# EAGLE design USB Host Wing RP2040 (EAGLE 9.5.2)
COMPANY: ADAFRUIT INDUSTRIES; DRAWN: KTOWN; REV: B
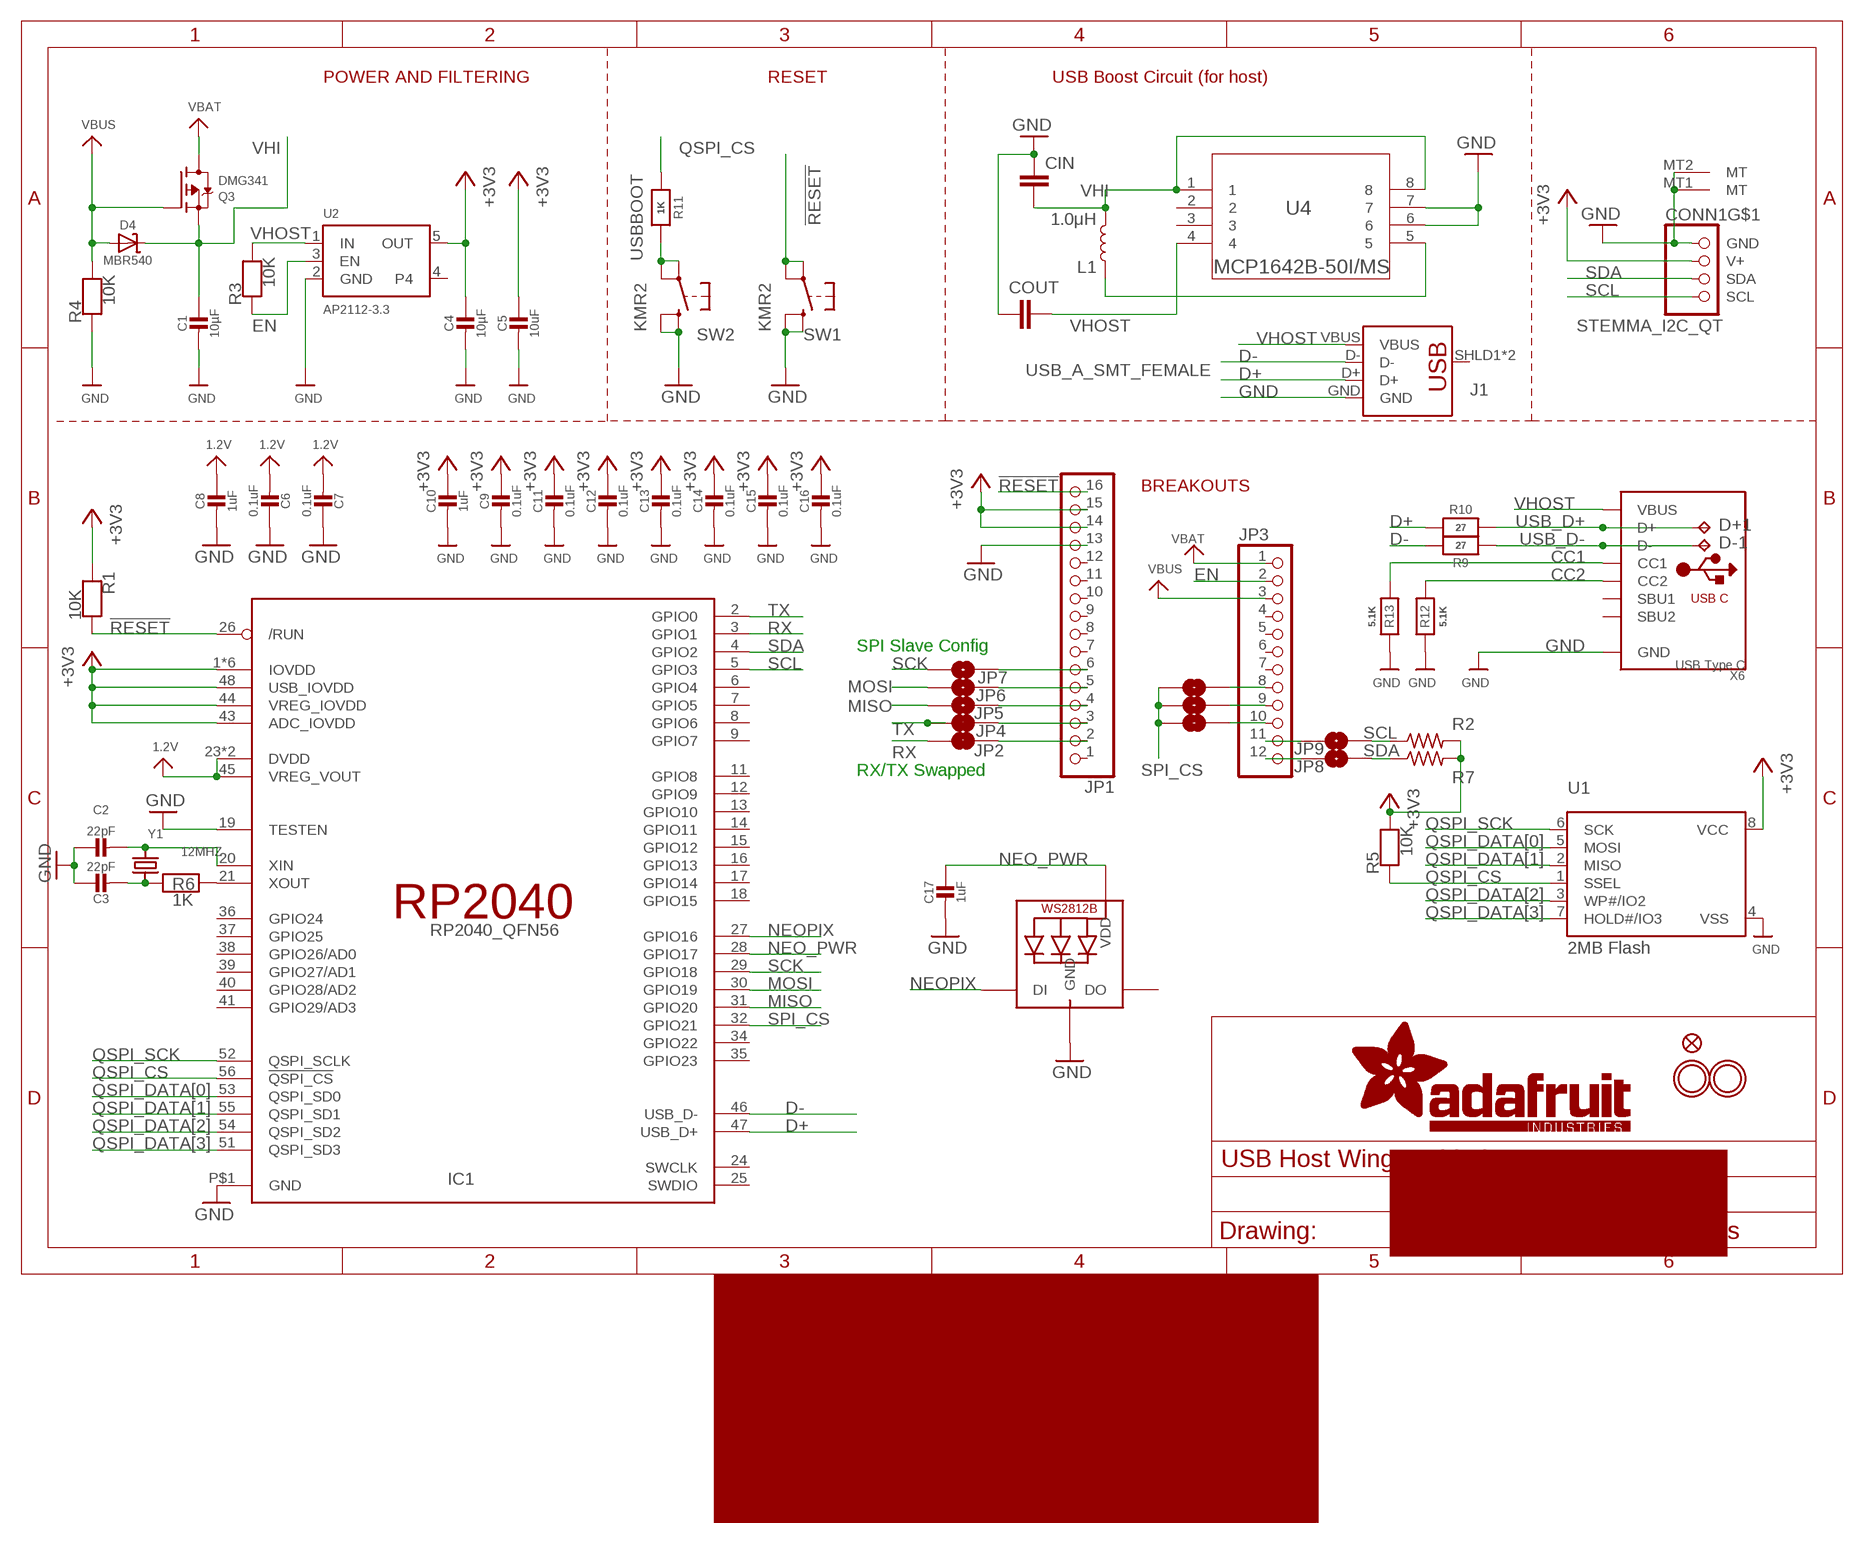
[diagram p0: schematic, sheet 1]

## Parts
C1  10µF  CAP_CERAMIC0805-NOOUTLINE  [0805-NO]
C2  22pF  CAP_CERAMIC0603_NO  [0603-NO]
C3  22pF  CAP_CERAMIC0603_NO  [0603-NO]
C4  10µF  CAP_CERAMIC0805-NOOUTLINE  [0805-NO]
C5  10uF  CAP_CERAMIC0805-NOOUTLINE  [0805-NO]
C6  0.1uF  CAP_CERAMIC0603_NO  [0603-NO]
C7  0.1uF  CAP_CERAMIC0603_NO  [0603-NO]
C8  1uF  CAP_CERAMIC0603_NO  [0603-NO]
C9  0.1uF  CAP_CERAMIC0603_NO  [0603-NO]
C10  1uF  CAP_CERAMIC0603_NO  [0603-NO]
C11  0.1uF  CAP_CERAMIC0603_NO  [0603-NO]
C12  0.1uF  CAP_CERAMIC0603_NO  [0603-NO]
C13  0.1uF  CAP_CERAMIC0603_NO  [0603-NO]
C14  0.1uF  CAP_CERAMIC0603_NO  [0603-NO]
C15  0.1uF  CAP_CERAMIC0603_NO  [0603-NO]
C16  0.1uF  CAP_CERAMIC0603_NO  [0603-NO]
C17  1uF  CAP_CERAMIC0603_NO  [0603-NO]
CIN  SPARKFUN_CAP0603-CAP  [SPARKFUN_0603-CAP]
CONN1  STEMMA_I2C_QT  [JST_SH4]
COUT  SPARKFUN_CAP0603-CAP  [SPARKFUN_0603-CAP]
D4  MBR540  DIODE-SCHOTTKYSOD-123  [SOD-123]
D+1  TPB1,27  [B1,27]
D-1  TPB1,27  [B1,27]
IC1  RP2040_QFN56  [QFN56_7MM_REDUCEDEPAD]
J1  USB_A_SMT_FEMALE  [USB-A-S-SILK-FEMALE]
JP1  HEADER-1X16ROUND  [1X16_ROUND]
JP2  JUMPER-SMT_2_NC_TRACE_SILK  [SMT-JUMPER_2_NC_TRACE_SILK]
JP3  HEADER-1X12  [1X12_ROUND]
JP4  JUMPER-SMT_2_NC_TRACE_SILK  [SMT-JUMPER_2_NC_TRACE_SILK]
JP5  JUMPER-SMT_2_NO_SILK  [SMT-JUMPER_2_NO_SILK]
JP6  JUMPER-SMT_2_NO_SILK  [SMT-JUMPER_2_NO_SILK]
JP7  JUMPER-SMT_2_NO_SILK  [SMT-JUMPER_2_NO_SILK]
JP8  JUMPER-SMT_2_NO_SILK  [SMT-JUMPER_2_NO_SILK]
JP9  JUMPER-SMT_2_NO_SILK  [SMT-JUMPER_2_NO_SILK]
JP10  JUMPER-SMT_2_NO_SILK  [SMT-JUMPER_2_NO_SILK]
JP11  JUMPER-SMT_2_NO_SILK  [SMT-JUMPER_2_NO_SILK]
JP12  JUMPER-SMT_2_NO_SILK  [SMT-JUMPER_2_NO_SILK]
L1  1.0μH  1.0μH-0805_WIDE-1.0μH-1.4A-0.07OHM-1.4MM_H  [0805-WIDE]
LED1  WS2812B3535  [LED3535]
Q3  DMG341  MOSFET-P  [SOT23-R]
R1  10K  RESISTOR_0603_NOOUT  [0603-NO]
R2  R-US_R0603  [R0603]
R3  10K  RESISTOR_0603_NOOUT  [0603-NO]
R4  10K  RESISTOR_0603_NOOUT  [0603-NO]
R5  10K  RESISTOR_0603_NOOUT  [0603-NO]
R6  1K  RESISTOR_0603_NOOUT  [0603-NO]
R7  R-US_R0603  [R0603]
R9  27  RESISTOR_0603_NOOUT  [0603-NO]
R10  27  RESISTOR_0603_NOOUT  [0603-NO]
R11  1K  RESISTOR_0603_NOOUT  [0603-NO]
R12  5.1K  RESISTOR_0603_NOOUT  [0603-NO]
R13  5.1K  RESISTOR_0603_NOOUT  [0603-NO]
SW1  KMR2  SWITCH_TACT_SMT4.6X2.8  [BTN_KMR2_4.6X2.8]
SW2  KMR2  SWITCH_TACT_SMT4.6X2.8  [BTN_KMR2_4.6X2.8]
U1  2MB Flash  SPIFLASH_8PIN208MIL  [SOIC8_208MIL]
U2  AP2112-3.3  VREG_SOT23-5  [SOT23-5@1]
U4  MCP1642B-50I/MS  [MSOP8_MCP1642B-50I/MS_MCH]
U$31  MOUNTINGHOLE2.5  [MOUNTINGHOLE_2.5_PLATED]
U$32  MOUNTINGHOLE2.5  [MOUNTINGHOLE_2.5_PLATED]
U$35  FIDUCIAL_1MM  [FIDUCIAL_1MM]
X6  USB Type C  USB_C  [USB_C_CUSB31-CFM2AX-01-X]
Y1  12MHZ  CRYSTAL2.5X2.0  [CRYSTAL_2.5X2]

## Nets
1.2V: C6.2 C7.2 C8.1 IC1.23(DVDD) IC1.45(VREG_VOUT) IC1.50(DVDD)
!RESET: IC1.26(/RUN) JP1.16 R1.2 SW1.A'(P1) SW1.A(P)
+3V3: C4.1 C5.1 C9.1 C10.1 C11.1 C12.1 C13.1 C14.1 C15.1 C16.1 CONN1.2(V+) IC1.1(IOVDD) IC1.10(IOVDD) IC1.22(IOVDD) IC1.33(IOVDD) IC1.42(IOVDD) IC1.43(ADC_IOVDD) IC1.44(VREG_IOVDD) IC1.48(USB_IOVDD) IC1.49(IOVDD) JP1.14 JP1.15 R1.1 R2.2 R5.2 R7.2 U1.8(VCC) U2.5(OUT)
CC1: R13.2 X6.A5(CC1)
CC2: R12.2 X6.B5(CC2)
D+: IC1.47(USB_D+) J1.D+ R10.2
D-: IC1.46(USB_D-) J1.D- R9.2
EN: JP3.2 R3.1 U2.3(EN)
GND [power]: C1.2 C2.1 C3.1 C4.2 C5.2 C6.1 C7.1 C8.2 C9.2 C10.2 C11.2 C12.2 C13.2 C14.2 C15.2 C16.2 C17.2 CIN.1 CONN1.1(GND) CONN1.MT1(MT) CONN1.MT2(MT) COUT.1 IC1.19(TESTEN) IC1.P$1(GND) J1.GND JP1.13 LED1.4(GND) R4.1 R12.1 R13.1 SW1.B'(S1) SW1.B(S) SW2.B'(S1) SW2.B(S) U1.4(VSS) U2.2(GND) U4.6 U4.7 X6.A1B12(GND) X6.B1A12(GND)
MISO: IC1.31(GPIO20) JP5.1
MOSI: IC1.30(GPIO19) JP6.1
N$1: JP1.6 JP7.2
N$2: JP1.5 JP6.2
N$3: JP1.4 JP5.2
N$4: JP1.3 JP4.2
N$5: C2.2 IC1.20(XIN) Y1.3
N$6: C3.2 R6.1 Y1.1
N$7: IC1.21(XOUT) R6.2
N$8: JP1.2 JP2.2
N$9: JP3.11 JP9.1
N$10: L1.1 U4.5
N$11: JP3.12 JP8.1
N$12: JP3.8 JP12.2
N$13: JP3.9 JP11.2
N$14: JP3.10 JP10.2
NEO_PWR: C17.1 IC1.28(GPIO17) LED1.2(VDD)
NEOPIX: IC1.27(GPIO16) LED1.1(DI)
QSPI_CS: IC1.56(!QSPI_CS) R5.1 R11.1 U1.1(SSEL)
QSPI_DATA[0]: IC1.53(QSPI_SD0) U1.5(MOSI)
QSPI_DATA[1]: IC1.55(QSPI_SD1) U1.2(MISO)
QSPI_DATA[2]: IC1.54(QSPI_SD2) U1.3(WP#/IO2)
QSPI_DATA[3]: IC1.51(QSPI_SD3) U1.7(HOLD#/IO3)
QSPI_SCK: IC1.52(QSPI_SCLK) U1.6(SCK)
RX: IC1.3(GPIO1) JP2.1
SCK: IC1.29(GPIO18) JP7.1
SCL: CONN1.4(SCL) IC1.5(GPIO3) JP9.2 R2.1
SDA: CONN1.3(SDA) IC1.4(GPIO2) JP8.2 R7.1
SPI_CS: IC1.32(GPIO21) JP10.1 JP11.1 JP12.1
TX: IC1.2(GPIO0) JP4.1
USB_D+: D+1.TP R10.1 X6.A6(D+) X6.B6(D+)
USB_D-: D-1.TP R9.1 X6.A7(D-) X6.B7(D-)
USBBOOT: R11.2 SW2.A'(P1) SW2.A(P)
VBAT [power]: JP3.1 Q3.3(D)
VBUS [power]: D4.A JP3.3 Q3.1(G) R4.2
VHI [power]: C1.1 CIN.2 D4.C L1.2 Q3.2(S) U4.1 U4.8
VHOST: COUT.2 J1.VBUS R3.2 U2.1(IN) U4.4 X6.A4B9(VBUS) X6.B4A9(VBUS)
Unconnected: IC1.6(GPIO4) IC1.7(GPIO5) IC1.8(GPIO6) IC1.9(GPIO7) IC1.11(GPIO8) IC1.12(GPIO9) IC1.13(GPIO10) IC1.14(GPIO11) IC1.15(GPIO12) IC1.16(GPIO13) IC1.17(GPIO14) IC1.18(GPIO15) IC1.24(SWCLK) IC1.25(SWDIO) IC1.34(GPIO22) IC1.35(GPIO23) IC1.36(GPIO24) IC1.37(GPIO25) IC1.38(GPIO26/AD0) IC1.39(GPIO27/AD1) IC1.40(GPIO28/AD2) IC1.41(GPIO29/AD3) J1.SHLD1(SHIELD) J1.SHLD2(SHIELD) JP1.1 JP1.7 JP1.8 JP1.9 JP1.10 JP1.11 JP1.12 JP3.4 JP3.5 JP3.6 JP3.7 LED1.3(DO) U2.4 U4.2 U4.3 X6.A8(SBU1) X6.B8(SBU2)

## Notes on the sheet
- POWER AND FILTERING | RESET | USB Boost Circuit (for host)
- BREAKOUTS
- SPI Slave Config
- RX/TX Swapped

## Library data of the parts
C1-C3 C5-C17 = microbuilder:CAP_CERAMIC: Ceramic Capacitors For new designs, use the packages preceded by an '_' character since they are more reliable: The following footprints should be used on most boards: _0402 - Standard footprint for regular board layouts _0603 - Standard footprint for regular board layouts _0805 - Standard footprint for regular board layouts _1206 - Standard footprint for regular board layouts For extremely tight-pitch boards where space is at a premium, the following 'micro-pitch' footprints can be used (smaller pads, no silkscreen outline, etc.): _0402MP - Micro-pitch footprint for very dense/compact boards _0603MP - Micro-pitch footprint for very dense/compact boards _0805MP - Micro-pitch footprint for very dense/compact boards _1206MP - Micro-pitch footprint for very dense/compact boards
C4 = microbuilder:CAP_CERAMIC: Ceramic Capacitors For new designs, use the packages preceded by an '_' character since they are more reliable: The following footprints should be used on most boards: _0402 - Standard footprint for regular board layouts _0603 - Standard footprint for regular board layouts _0805 - Standard footprint for regular board layouts _1206 - Standard footprint for regular board layouts For extremely tight-pitch boards where space is at a premium, the following 'micro-pitch' footprints can be used (smaller pads, no silkscreen outline, etc.): _0402MP - Micro-pitch footprint for very dense/compact boards _0603MP - Micro-pitch footprint for very dense/compact boards _0805MP - Micro-pitch footprint for very dense/compact boards _1206MP - Micro-pitch footprint for very dense/compact boards; REV: A
CIN COUT = DECADE:SPARKFUN_CAP: Capacitor Standard 0603 ceramic capacitor, and 0.1" leaded capacitor.
CONN1 = microbuilder:STEMMA_I2C
D4 = microbuilder:DIODE-SCHOTTKY
D+1 D-1 = testpad:TP: Test pad
IC1 = adafruit_micro:RP2040
J1 = SparkFun-Connectors:USB_A: USB-A Connector Male and female variants, as well as PTH and SMT variants SparkFun Products: SparkFun XBee Explorer Dongle <https://www.sparkfun.com/products/11697> PTH Male SparkFun MicroView-USB Programmer <https://www.sparkfun.com/products/12924> SMT Male SparkFun USB Type A Female Breakout <https://www.sparkfun.com/products/12700> SMT Female; PROD_ID: CONN-09520; SF_ID: PRT-09011
JP1 = microbuilder:HEADER-1X16: PIN HEADER
JP2 JP4 = SparkFun-Jumpers:JUMPER-SMT_2_NC_TRACE: Normally closed trace jumper This jumper has a trace between two pads so it's normally closed (NC). Use a razor knife to open the connection. For best results follow the IPC guidelines for cutting traces: Cutout at least 0.063 mm (0.005 in). Remove all loose material to clean up the cut area. Seal the cut with an approved epoxy. Reapply solder to reclose the connection.
JP3 = microbuilder:HEADER-1X12
JP5-JP12 = SparkFun-Jumpers:JUMPER-SMT_2_NO: Normally open jumper This jumper has two pads in close proximity to each other. Apply solder to close the connection. Round pads are easier to solder for beginners, but are a lot larger. SparkFun Product that uses the round pads: SparkFun EL Sequencer <https://www.sparkfun.com/products/12781>
L1 = SparkFun-Coils:1.0μH: 1.0μH Inductor Resist changes in electrical current. Basically a coil of wire. SparkFun Products: SparkFun Edge <https://www.sparkfun.com/products/15170>; PROD_ID: NDUC-14237
LED1 = microbuilder:WS2812B
Q3 = microbuilder:MOSFET-P: P-Channel Mosfet LEGEND VDS: Voltage Drain-Source ID: Drain Current RDS(ON): Drain-Source On-State Resistance VGS(TH): Gate-Source Threshold Voltage CISS: Drain-Source Input Capacitance SOT-23 Name VDS ID RDS(ON) VGS(TH) CISS Order Number IRLML5103 30V 760mA 600 mOhm -- 75pF @ 25V Digikey: IRLML5103PBFCT-ND IRLML6401 12V 4.3A 50 mOhm 950mV @ 250µA 830pF @ 10V Digikey: IRLML6401PBFTR-ND NTR0202PL 20V 400mA 800 mOhm 2.3V @ 250uA 70pF @ 5V Digikey: NTR0202PLT1GOSTR-ND NTR4101PT1G 20V 1.8A 85 mOhm 1.2V @ 250uA 675pF @ 10V Digikey: NTR4101PT1GOSCT-ND DMP2004K 20V 600mA 900 mOhm 1V @ 250uA 175pF @ 16V Digikey: DMP2004KDICT-ND PMV65XP 20V 3.9A 76 mOhm 950mV @ 1mA 725pF @ 20V Digikey: 568-2358-2-ND TO-252 Name VDS ID RDS(ON) VGS(TH) CISS Order Number AOD417 30V 25A 34 mOhm 3V @ 250µA 920pF @ 15V Digikey: 785-1106-2-ND PowerPak Name VDS ID RDS(ON) VGS(TH) CISS Order Number AON7401 30V 12A 14 mOhm 3V @ 250µA 2600pF @ 15V Digikey: 785-1302-1-ND
R1 R3-R6 R9-R13 = microbuilder:RESISTOR: Resistors For new designs, use the packages preceded by an '_' character since they are more reliable: The following footprints should be used on most boards: _0402 - Standard footprint for regular board layouts _0603 - Standard footprint for regular board layouts _0805 - Standard footprint for regular board layouts _1206 - Standard footprint for regular board layouts For extremely tight-pitch boards where space is at a premium, the following 'micro-pitch' footprints can be used (smaller pads, no silkscreen outline, etc.): _0402MP - Micro-pitch footprint for very dense/compact boards _0603MP - Micro-pitch footprint for very dense/compact boards _0805MP - Micro-pitch footprint for very dense/compact boards _1206MP - Micro-pitch footprint for very dense/compact boards
R2 R7 = adafruit:R-US_: RESISTOR, American symbol
SW1 SW2 = microbuilder:SWITCH_TACT_SMT: SMT Tact Switches 6x6mm - Digikey: P12940SCT-ND KMR2 (4.6x2.8mm) - Digikey: 401-1426-1-ND EVQ-PQHB55 - Light Touch, 160GF (4.5x4.5mm) - Digikey: P8090SCT-ND KMT0 - KMT021 NGJ LHS (etc.) IP68/Waterproof - Digikey: CKN10289CT-ND
U1 = microbuilder:SPIFLASH_8PIN: SOIC8 SPI Flash Be careful with the size since SOIC8 flash comes in several 'widths' SOIC8 150 mil M25P16 - 16Mbit (2Mbit x 8) Serial Flash (75MHz SPI Bus), Supply: 2.7-3.6V Digikey: SOIC8 - M25P16-VMN6P-ND SOIC8 208 mil W25Q16BVSSIG - 16Mbit (2Mbit x 8) Serial Flash (104MHz SPI Bus), Supply: 2.7-3.6V Digikey: SOIC8 - W25Q16BVSSIG-ND
U2 = microbuilder:VREG_SOT23-5: SOT23-5 Fixed Voltage Regulators Part Current Out V Out V In V Dropout θJA (°C/W) TJ (°C) Digikey Part No. ADP121 150mA 3.3V 3.4-5.5V 0.09V @ 150mA -- -- ADP121-AUJZ33R7CT-ND ADP121 150mA 3.0V 3.1-5.5V 0.09V @ 150mA -- -- ADP121-AUJZ30R7CT-ND ADP122 300mA 3.3V 3.4-5.5V 0.085V @ 300mA -- -- ADP122AUJZ-3.3-R7CT-ND ADP1712 300mA 3.3V 3.5-5.5V 0.17V @ 300mA -- -- ADP1712AUJZ-3.3-R7TR-ND AP7311 (Low Cost) 150mA 3.3V 3.5-6V 0.15V @ 150mA -- -- AP7311-33WG-7DICT-ND LD39015M18R 150mA 1.8V 1.9V-5.5V 0.08V @ 100mA -- -- 497-6977-1-ND LP2985A-33DBVR 150mA 3.3V 3.3-16V 0.28V @ 150mA 206 150 296-18479-1-ND MCP1824T-3302E/OT 300mA 3.3V 3.5V-6V 0.2V @ 300mA -- -- MCP1824T-3302E/OTCT-ND MIC5205-2.5YM5 TR 150mA 2.5V 2.7-16V 0.165V @ 150mA -- -- 576-1257-2-ND MIC5205-3.0YM5 TR 150mA 3.0V 3.2V-16V 0.165V @ 150mA -- -- 576-1258-2-ND MIC5205-3.3YM5 TR 150mA 3.3V 3.5V-16V 0.165V @ 150mA -- -- 576-1259-2-ND TPS780330220 150mA 3.3V+2.2V 3.6-5.5V 250mV Max -- -- 296-23332-1-ND TDA3663/N1,135 100mA 3.3V 3.5-45V 0.18V @ 50mA -- -- 568-5343-1-ND Max operating temp can be calculated using θJA, TJ (max junction temperature), and power in watts. Set the "Maximum Ambient Temperature" until it reaches TJ ("Max Junction Temperature"), which is the absolute limit for safe use of the regulator: Heat Sink Temperature Calculator <http://www.daycounter.com/Calculators/Heat-Sink-Temperature-Calculator.phtml> For example, With 12V source into a 3.3V LP2985 and a 30mA load, we are dissipating (12V-3.3V) * 0.03A = 0.261W. With a θJA of 206 °C/W, a TJ of 150°C, and 261mW we can safely use the chip without a heat sink up to 75°C (=147.1°C Junction Temperature).
U4 = ATMakers:MCP1642B-50I/MS; BUILT_BY: EMA_Kyle; COPYRIGHT: Copyright (C) 2018 Accelerated Designs. All rights reserved; DATASHEET: https://ww1.microchip.com/downloads/en/DeviceDoc/20005253A.pdf; MANUFACTURER_PART_NUMBER: MCP1642B-50I/MS; SOURCELIBRARY: Add_to_database_2021-01-13; VENDOR: Microchip
U$31 U$32 = microbuilder:MOUNTINGHOLE: Mounting Hole For #2 screws (0.086"/2.18mm width, 0.094"/2.4mm hole) use 2.5mm; BOM: EXCLUDE
U$35 = microbuilder:FIDUCIAL: Fiducial Alignment Points Various fiducial points for machine vision alignment.; BOM: EXCLUDE
X6 = microbuilder:USB_C: USB Type-C USB 2.0 Connector
Y1 = microbuilder:CRYSTAL: Crystals HC49UP - Surface Mount Crystal 4.0MHz 18pF +/-30ppm Surface Mount Crystal [Digikey: 535-9857-1-ND] 12.0 MHz Surface Mount Crystal [Digikey: 535-9869-6-ND] 25.0 MHz Surface Mount Crystal [Digikey: 535-9078-1-ND] 2.5 x 2.0mm - MEMs SMT Crystal 16.0 MHz 10pF 20ppm 2.5 x 2.0mm Crystal [Digikey -40-85°C: 535-10923-1-ND] 3.2 x 2.5mm - MEMs SMT Crystal 12.0 MHz 8pF 15ppm 3.2 x 2.5mm Crystal [Digikey: -10-70°C: 644-1047-1-ND -40-125°C: 644-1128-1-ND] 40~85°C cheaper: 644-1173-6-ND 16.0 MHz 8pF 15ppm 3.2 x 2.5mm Crystal [Digikey: -10-70°C: 644-1049-1-ND -40-125°C: 644-1129-2-ND]-40~85°C cheaper: 644-1175-6-ND 16.0 MHz 10pF 10ppm 3.2 x 2.5mm Crystal [Digikey: 644-1100-1-ND] 27.12 MHz 18pF 30ppm 3.2 x 2.5mm Crystal [Digikey: 887-1424-1-ND] 27.12MHz 10pF 10ppm 3.2 x 2.5mm Crystal [Digikey: 887-1329-1-ND] 4.9 x 1.8mm - MEMs SMT Crystal 32.768 KHz 12.5pF 20ppm 4.9 x 1.8mm Crystal [Digikey: SE2415CT-ND] 8.0 x 3.8mm - Surface Mount Crystal 32.768kHz 12.5pF 20ppm -40°C-85°C [Digikey: 535-9166-2-ND] Cylinder 32.768KHz Cylinder Crystal (2x6mm body) [Ex. Digikey: 300-8341-2-ND]

## Net classes
1 power: width 0.305 mm
2 gnd: width 0.254 mm

## Board
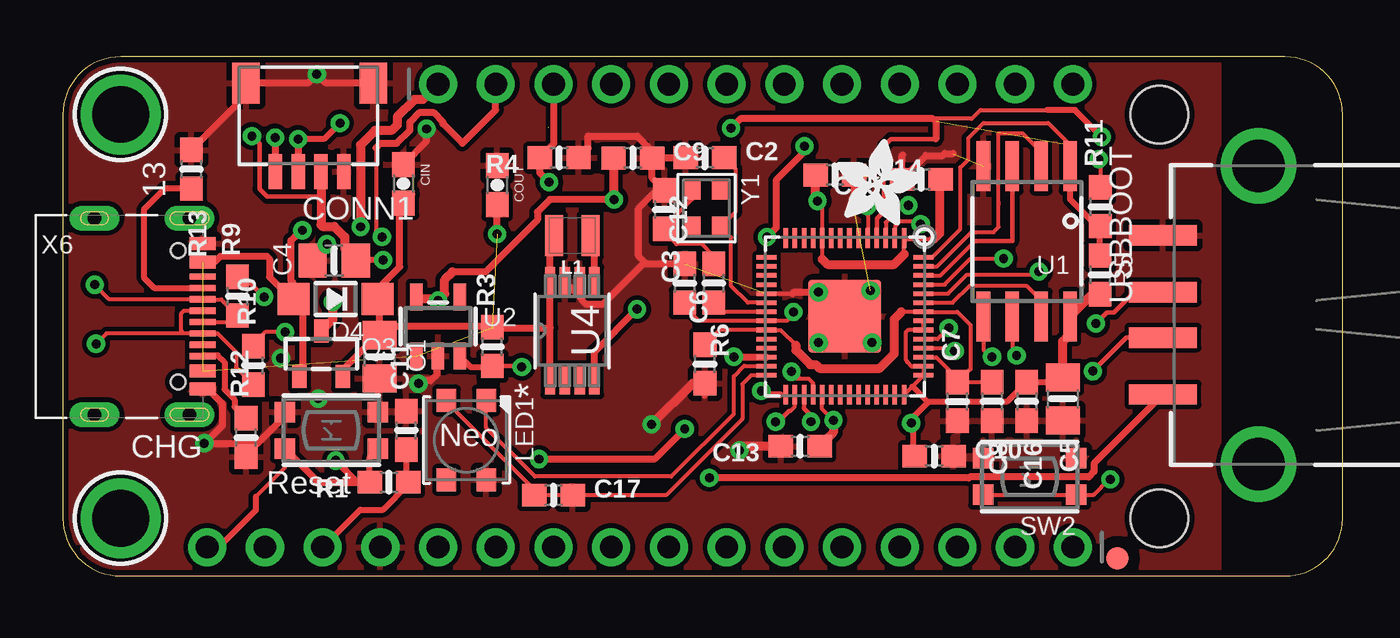
[diagram p1: board, top side]
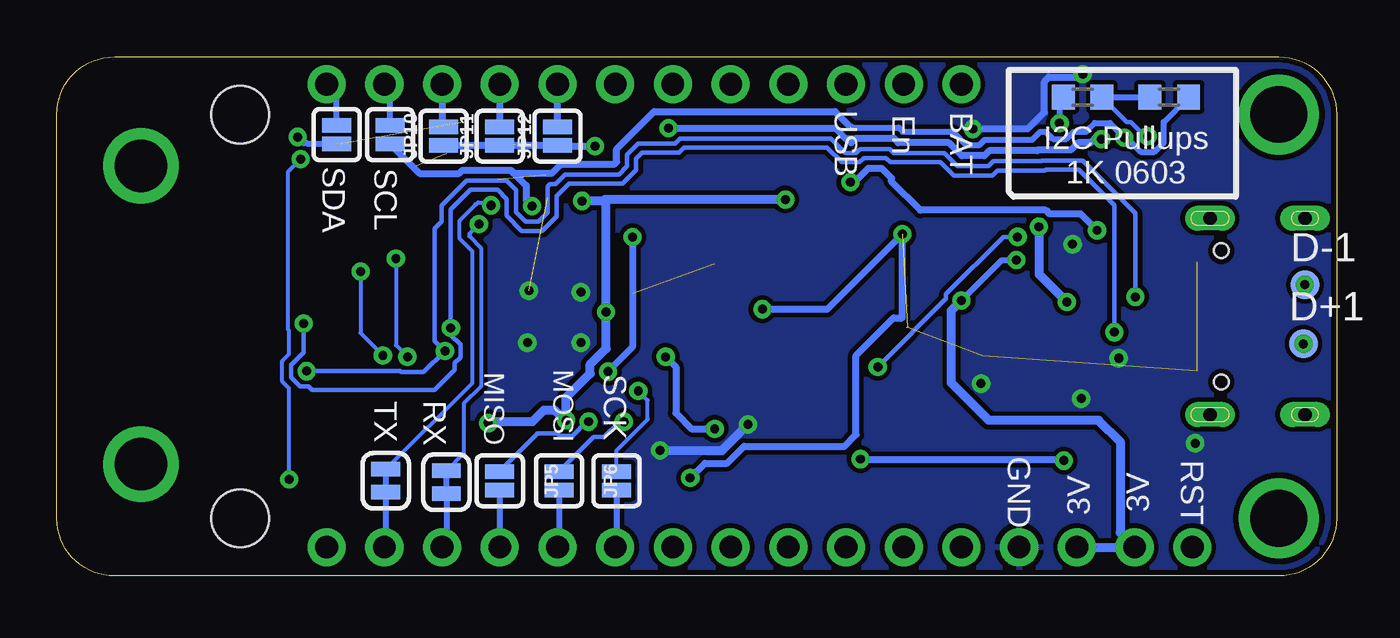
[diagram p2: board, bottom side, seen from below]

Size 56.32 x 22.86 mm. Coordinates in mm from the lower left corner, seen from the top.
Outline: 2.54,0 53.78,0 arc90 56.33,2.54 56.33,20.32 arc90 53.78,22.86 2.54,22.86 arc90 0,20.32 0,2.54 arc90 2.54,0
Copper layers (1*16): Top 0.035mm / dielectric 1.5mm / Bottom 0.035mm
Design rules "adafruit 7-7 *": minimum track width 7mil, minimum drill 15.5mil, track to track 8mil, track to pad 7mil, pad to pad 7mil, via to via 7mil, smd to smd 7mil, copper to edge 10mil, drill to drill 8mil, minimum pad ring 10mil, minimum via ring 8mil, stop-mask expansion 2mil, vias tented up to drill 20mil, thermal gap 10mil
Holes 2.54 mm at 48.26,20.32 48.26,2.54

### Footprints (pad centres in the part's own frame; a part is rotated, then mirrored left to right if it is on the bottom)
0805-NO = smd 1.24 x 1.5: 1 -0.95,0; 2 0.95,0
0603-NO = smd 1.075 x 1: 1 -0.85,0; 2 0.85,0
SPARKFUN_0603-CAP = smd 1.1 x 1: 1 -0.85,0; 2 0.85,0
JST_SH4 = smd 0.6 x 1.55: 1 -1.5,2.514; 2 -0.5,2.514; 3 0.5,2.514; 4 1.5,2.514 | smd 1.2 x 1.8: MT1 -2.8,-1.386; MT2 2.8,-1.386
SOD-123 = smd 1.4 x 1.4: A 1.85,0; C -1.85,0
B1,27 = smd 1.27 x 1.27: TP 0,0
QFN56_7MM_REDUCEDEPAD = smd 0.875 x 0.2: 1 -3.45,2.6; 2 -3.45,2.2; 3 -3.45,1.8; 4 -3.45,1.4; 5 -3.45,1; 6 -3.45,0.6; 7 -3.45,0.2; 8 -3.45,-0.2; 9 -3.45,-0.6; 10 -3.45,-1; 11 -3.45,-1.4; 12 -3.45,-1.8; 13 -3.45,-2.2; 14 -3.45,-2.6; 29 3.45,-2.6; 30 3.45,-2.2; 31 3.45,-1.8; 32 3.45,-1.4; 33 3.45,-1; 34 3.45,-0.6; 35 3.45,-0.2; 36 3.45,0.2; 37 3.45,0.6; 38 3.45,1; 39 3.45,1.4; 40 3.45,1.8; 41 3.45,2.2; 42 3.45,2.6 | smd 0.2 x 0.875: 15 -2.6,-3.45; 16 -2.2,-3.45; 17 -1.8,-3.45; 18 -1.4,-3.45; 19 -1,-3.45; 20 -0.6,-3.45; 21 -0.2,-3.45; 22 0.2,-3.45; 23 0.6,-3.45; 24 1,-3.45; 25 1.4,-3.45; 26 1.8,-3.45; 27 2.2,-3.45; 28 2.6,-3.45; 43 2.6,3.45; 44 2.2,3.45; 45 1.8,3.45; 46 1.4,3.45; 47 1,3.45; 48 0.6,3.45; 49 0.2,3.45; 50 -0.2,3.45; 51 -0.6,3.45; 52 -1,3.45; 53 -1.4,3.45; 54 -1.8,3.45; 55 -2.2,3.45; 56 -2.6,3.45 | smd 3.2 x 3.2: P$1 0,0
USB-A-S-SILK-FEMALE = smd 3 x 0.9: D+ 7.212,-1; D- 7.212,1; GND 7.212,-3.5; VBUS 7.212,3.5 | drill 2.311: SHLD1 3,-6.566; SHLD2 3,6.566
1X16_ROUND = drill 1 pad 1.676: 1 -19.05,0; 2 -16.51,0; 3 -13.97,0; 4 -11.43,0; 5 -8.89,0; 6 -6.35,0; 7 -3.81,0; 8 -1.27,0; 9 1.27,0; 10 3.81,0; 11 6.35,0; 12 8.89,0; 13 11.43,0; 14 13.97,0; 15 16.51,0; 16 19.05,0
SMT-JUMPER_2_NC_TRACE_SILK = smd 0.635 x 1.27: 1 -0.508,0; 2 0.508,0
1X12_ROUND = drill 1 pad 1.676: 1 -13.97,0; 2 -11.43,0; 3 -8.89,0; 4 -6.35,0; 5 -3.81,0; 6 -1.27,0; 7 1.27,0; 8 3.81,0; 9 6.35,0; 10 8.89,0; 11 11.43,0; 12 13.97,0
SMT-JUMPER_2_NO_SILK = smd 0.635 x 1.27: 1 -0.406,0; 2 0.406,0
0805-WIDE = smd 0.8 x 1.8: 1 -0.8,0; 2 0.8,0
LED3535 = smd 1 x 0.85: 1 -1.75,0.875; 2 -1.75,-0.875; 3 1.75,-0.875; 4 1.75,0.875
SOT23-R = smd 0.635 x 1.016: 1 -0.95,-1; 2 0.95,-1; 3 0,1
R0603 = smd 1 x 1.1: 1 -0.85,0; 2 0.85,0
BTN_KMR2_4.6X2.8 = smd 0.9 x 0.9: A 2.05,0.8; A' -2.05,0.8; B 2.05,-0.8; B' -2.05,-0.8
SOIC8_208MIL = smd 0.6 x 2.2: 1 -1.905,-3.315; 2 -0.635,-3.315; 3 0.635,-3.315; 4 1.905,-3.315; 5 1.905,3.315; 6 0.635,3.315; 7 -0.635,3.315; 8 -1.905,3.315
SOT23-5@1 = smd 0.55 x 1.2: 1 -0.95,-1.3; 2 0,-1.3; 3 0.95,-1.3; 4 0.95,1.3; 5 -0.95,1.3
MSOP8_MCP1642B-50I/MS_MCH = smd 1.307 x 0.457: 1 -2.152,0.975; 2 -2.152,0.325; 3 -2.152,-0.325; 4 -2.152,-0.975; 5 2.152,-0.975; 6 2.152,-0.325; 7 2.152,0.325; 8 2.152,0.975
MOUNTINGHOLE_2.5_PLATED = drill 2.5 pad 3.2: P$1 0,0
FIDUCIAL_1MM = smd 1 x 1: 1 0,0
USB_C_CUSB31-CFM2AX-01-X = smd 0.575 x 1.15: A1B12 -3.2,3.545; A4B9 -2.4,3.545; B1A12 3.2,3.545; B4A9 2.4,3.545 | smd 0.275 x 1.15: A5 -1.25,3.545; A6 -0.25,3.545; A7 0.25,3.545; A8 1.25,3.545; B5 1.75,3.545; B6 0.75,3.545; B7 -0.75,3.545; B8 -1.75,3.545 | drill 0.6 pad 1 long: M1 -4.32,2.97; M2 4.32,2.97; M3 -4.32,-1.21; M4 4.32,-1.21 | hole 0.65: 2.89,2.47; -2.89,2.47
CRYSTAL_2.5X2 = smd 0.9 x 0.75: 1 -0.825,-0.625; 2 0.825,-0.625; 3 0.825,0.625; 4 -0.825,0.625

### Placement (x,y rotation side)
C1  13.95,9.65 270 top
C2  28.26,18.41 0 top
C3  26.48,16.13 270 top
C4  11.94,13.89 180 top
C5  44.01,7.8 270 top
C6  28.26,9.33 90 top
C7  39.37,7.68 90 top
C8  40.89,7.68 270 top
C9  25.08,18.4 0 top
C10  38.35,5.28 0 top
C11  15.11,6.41 90 top
C12  27.37,12.89 90 top
C13  32.45,5.71 180 top
C14  33.97,17.65 0 top
C15  37.78,17.46 180 top
C16  42.42,7.68 270 top
C17  21.59,3.56 0 top
CIN  14.99,17.27 270 top
CONN1  10.86,20.32 180 top
COUT  19.11,17.21 270 top
D4  12,12.19 180 top
D+1  1.46,10.22 0 bottom
D-1  1.4,12.83 0 bottom
IC1  34.42,11.43 270 top
J1  55.63,11.49 180 top
JP1  25.4,1.27 180 top
JP2  41.85,4.19 270 bottom
JP3  30.48,21.65 0 top
JP4  39.18,4.13 270 bottom
JP5  36.83,4.19 270 bottom
JP6  34.23,4.19 270 bottom
JP7  31.69,4.19 270 bottom
JP8  44.01,19.43 270 bottom
JP9  41.66,19.43 270 bottom
JP10  39.31,19.37 90 bottom
JP11  36.83,19.37 90 bottom
JP12  34.29,19.37 90 bottom
L1  22.42,14.99 180 top
LED1  17.75,5.98 270 top
Q3  11.37,9.78 0 top
R1  14.35,4.13 180 top
R2  7.37,21.08 180 bottom
R3  18.9,10.1 90 top
R4  21.84,18.41 180 top
R5  45.64,13.26 270 top
R6  28.64,12.89 270 top
R7  11.18,21.08 0 bottom
R9  7.68,12.32 90 top
R10  8.38,9.27 90 top
R11  45.66,16.26 90 top
R12  8.06,6.1 90 top
R13  5.65,17.91 270 top
SW1  11.81,6.41 180 top
SW2  42.55,4.38 180 top
U1  42.42,14.73 180 top
U2  16.51,10.99 0 top
U4  22.42,10.79 90 top
U$28  [ADAFRUIT_3.5MM]  34.04,15.43 0 top
U$31  2.54,20.32 270 top
U$32  2.54,2.54 270 top
U$35  46.4,0.77 270 top
X6  2.6,11.43 270 top
Y1  28.32,16.19 270 top

### Tracks (layer width: path | path; a pad name or v marks a point on that pad's centre or on a via)
1.2V
  Top 0.178: 36.9,11.63 IC1.50 39.36,11.63 39.94,11.05 39.94,9.11 39.45,8.62 | 32.26,10.16 31.59,10.83 IC1.23 28.9,10.83 C6.2 | 39.45,8.62 C7.2 C8.1 | IC1.45 38.44,9.63 39.45,8.62
  Top 0.406: 36.9,11.63 36.58,11.3 36.58,9.78 35.94,9.14 33.3,9.14 33.14,9.31 32.9,9.31 32.26,9.94 32.26,10.16
!RESET  (via drill 0.39)
  Top 0.178: SW1.A 9.76,4.77 8.48,3.49
  Top 0.254: JP1.16 6.86,1.27 8.48,2.9 8.48,3.49 | R1.2 13.5,5.25 SW1.A'
  Top 0.305: SW1.A 11.25,4.13 12.95,4.13 | R1.2 13.21,4.13 12.95,4.13 | IC1.26 29.55,9.63 v29.53,9.65 | v27.37,6.48 26.04,5.14 v20.95,5.14 | v12,5.08 12.95,4.13
  Bottom 0.305: v29.53,9.65 29.08,9.21 29.08,7.18 28.38,6.48 v27.37,6.48 | v20.95,5.14 12.06,5.14 v12,5.08
+3V3  (via drill 0.39, 0.4)
  Top 0.178: IC1.42 37.38,8.34 IC1.43 IC1.44 37.35,9.23 37.16,9.42 37.16,9.45 37.08,9.53 37.08,10.73 37.18,10.83 IC1.48 | IC1.33 33.42,7.35 v33.91,6.86 | 33.42,13.95 IC1.10 33.42,16.51 v33.21,16.51 | 37.02,14.16 IC1.1 37.08,14.82 38.31,14.82 | v32.15,11.62 32.15,11.53 31.86,11.23 IC1.22 27.99,11.23 27.37,11.85 C12.1 | C15.1 38.57,17.46 38.39,17.29
  Top 0.203: IC1.48 IC1.49 | v8.32,19.37 8.65,19.03 8.65,17.04 8.99,16.7 11.36,16.7
  Top 0.254: JP1.14 13.08,2.92 14.1,2.92 15.2,4.03 R1.1 15.11,4.21 C11.1 | 38.03,7.69 38.07,7.65 37.47,7.05 37.47,6.86 v37.34,6.73 37.4,6.67 37.4,5.5 C10.1 | 38.03,7.69 37.38,8.34 | 38.03,7.69 41.58,7.69 C16.1 43.79,8.53 C5.1 | v14.1,13.91 12.91,13.91 C4.1
  Top 0.305: U2.5 15.65,12.19 | 16.45,12.19 v16.51,12.13 | 24.23,16.6 v24.26,16.57 21.44,16.57 20.89,16.02 20.89,15.68 18.59,13.39 17.15,13.39
  Top 0.406: 16.45,12.19 15.65,12.19 | 33.42,13.95 33.66,13.72 36.58,13.72 37.02,14.16 | v33.21,16.51 33.12,16.6 C14.1 | 38.31,14.82 38.58,15.08 38.58,17.1 38.39,17.29 | v33.91,6.86 33.91,6.33 C13.1 | C9.1 24.23,16.6 | C5.1 44.01,10.34 44.26,10.59 44.26,11.35 U1.8 45.31,12.41 R5.2 | v16.51,12.13 16.8,12.42 16.8,13.04 17.15,13.39 | CONN1.2 11.36,16.7 11.36,15.45 11.43,15.39 11.94,15.39 12.4,14.93 12.4,14.41 12.91,13.91
  Bottom 0.178: 33.91,6.79 v33.91,6.86 | 32.15,16.57 32.19,16.57
  Bottom 0.203: R7.2 9.23,19.98 9.05,19.98 8.44,19.37 v8.32,19.37
  Bottom 0.254: v16.51,12.13 14.73,13.91 v14.1,13.91 | R7.2 R2.2
  Bottom 0.305: 16.95,8.49 16.95,8.51
  Bottom 0.406: v16.51,12.13 16.95,11.68 16.95,8.51 15.3,6.86 10.48,6.86 9.53,5.91 9.53,1.91 JP1.15 JP1.14 | v37.34,6.73 37.27,6.79 35.39,6.79 34.88,7.3 34.42,7.3 33.91,6.79 | 32.19,16.57 32.26,16.51 v33.21,16.51 | v24.26,16.57 32.15,16.57 v32.15,11.62 32.15,10.02 32.85,9.32 32.85,8.92 33.91,7.86 v33.91,6.86
CC1
  Top 0.254: R13.2 4.48,17.06 3.56,16.13 3.56,13.14 4.02,12.68 X6.A5
CC2
  Top 0.254: X6.B5 6.18,9.71 6.82,9.71 7.11,9.42 7.11,8.22 7.56,7.77 7.56,7.45 R12.2
D+  (via drill 0.39, 0.4)
  Top 0.178: v9.78,10.73 8.89,10.73 8.38,10.22 R10.2 | IC1.47 38.5,10.43 38.8,10.73 v38.99,10.92
  Top 0.203: v45.47,11.11 45.95,11.59 46.26,11.59 47.16,12.49 J1.D+
  Bottom 0.203: 39.24,11.11 39.05,10.92 v38.99,10.92 | v9.78,10.73 9.78,16.32 11.35,17.89 12.8,17.89 12.83,17.86 14.93,17.86 15.15,17.63 16.85,17.63 17.43,18.21 19.64,18.21 19.83,18.4 20.81,18.4 21,18.21 21.78,18.21 22.42,18.85 28.73,18.85 28.95,18.63 30.57,18.63 30.82,18.37 30.82,17.87 31.42,17.27 33.78,17.27 34.33,16.73 34.33,15.83 34.73,15.43 34.76,15.39 34.96,15.2 35.86,15.2 36.53,15.86 36.53,16.6 36.93,17 38.12,17 38.99,16.13 v38.99,10.92 | v38.99,10.92 38.99,10.62 38.56,10.19 38.56,9.62 38.81,9.37 38.81,9.07 39.69,8.19 45.09,8.19 45.23,8.34 45.62,8.34 46.01,8.74 46.01,9.3 45.47,9.85 v45.47,11.11
D-  (via drill 0.39, 0.4)
  Top 0.178: v39.24,9.91 39.12,10.03 IC1.46
  Top 0.203: v8.86,12.29 7.98,13.17 R9.2 | v45.33,9.02 46.81,10.49 J1.D-
  Bottom 0.203: v8.86,12.29 8.86,15.99 11.17,18.29 12.97,18.29 13,18.26 15.1,18.26 15.32,18.04 16.68,18.04 17.26,18.62 19.48,18.62 19.66,18.8 20.98,18.8 21.16,18.62 21.61,18.62 22.25,19.26 28.9,19.26 29.12,19.04 30.73,19.04 31.23,18.54 31.23,18.04 31.59,17.68 33.95,17.68 34.37,17.26 34.61,17.26 34.73,17.14 34.73,16 35.13,15.6 35.69,15.6 36.12,16.03 36.12,17 36.53,17.41 38.28,17.41 39.4,16.3 39.4,15.6 39.69,15.3 39.69,10.35 v39.24,9.91 40.18,8.97 41.17,8.97 41.22,9.02 v45.33,9.02
EN  (via drill 0.39)
  Top 0.178: 13.78,18.86 13.78,15.19
  Top 0.203: R3.1 20.15,9.25 v20.19,9.21 | 13.78,15.19 v14.04,14.93
  Top 0.254: U2.3 17.96,9.18 18.73,9.18 18.79,9.25 R3.1
  Top 0.305: JP3.2 19.05,20.51 17.59,19.05 16.73,19.91 16.73,19.99 16.3,20.41 15.7,20.41 15.27,19.99 15.27,19.62 14.7,19.05 13.97,19.05 13.78,18.86
  Bottom 0.203: v20.19,9.21 17.19,12.21 17.19,12.41 14.67,14.93 v14.04,14.93
GND  (via drill 0.39, 0.4)  (4 unrouted)
  Top 0.178: IC1.19 32.11,12.43
  Top 0.305: U2.2 16.45,9.62 16.45,8.86 16.19,8.61 15.65,8.61 v15.65,8.47 | SW1.B 9.76,7.02 8.56,5.82 6.22,5.82 7.01,6.61 7.01,7.59 6.38,8.23 X6.B1A12 | 32.11,12.43 32.18,12.5 v33.26,12.5 34.33,11.43 IC1.P$1 | C6.1 28.26,7.96 | 26.3,17.16 25.93,17.53 C9.2 | 26.3,17.16 C3.1 | C9.2 25.95,18.41 C2.1 | R4.1 23.11,18.84 23.11,19.37 25.27,19.37 25.93,18.71 C9.2 | C12.2 25.69,13.74 | 25.69,13.74 25.34,14.1 25.34,16.19 26.3,17.16 | 39.18,18.61 38.81,18.61 38.72,18.51 37.98,18.51 C15.2 36.93,18.52 36.96,18.54 | CIN.1 16,19.14 v16,19.68 | R13.1 8.06,21.16 CONN1.MT2 10.78,21.71 v11.18,22.1 11.57,21.71 CONN1.MT1 | C4.2 11.62,14.52 v11.62,14.61 | C14.2 34.82,16.73 34.73,16.64 | 25.69,13.74 25.53,13.74 23.76,11.96 23.02,11.96 22.83,12.16 22.83,12.21 | 22.83,12.21 22.83,12.86 U4.6 | U4.7 22.83,12.21
  Top 0.406: C13.2 29.97,5.71 v29.78,5.52 | v25.91,6.67 27.73,8.48 C6.1
  Bottom 0.305: v16,19.68 13.59,19.68 12.86,20.42 12.86,21.77 12.66,21.96 11.31,21.96 v11.18,22.1
  Bottom 0.406: v29.78,5.52 27.05,5.52 v25.91,6.67
  other vias: 11.24,7.81 6.22,5.84 35.55,12.56 35.61,10.27 33.26,10.27 9.59,9.59
  pour Top: 0,22.86 0,0 50.86,-0.06 50.86,22.86
  pour Bottom: 50.93,0 0,0 0,22.86 50.93,22.86
MISO  (via drill 0.39)
  Top 0.178: IC1.31 32.62,7.45
  Top 0.203: v32.93,6.79 32.93,7.08 32.62,7.39 32.62,7.45
  Bottom 0.203: JP5.1 35.18,6.25 35.18,6.29 34.3,6.29 34.19,6.17 33.63,6.17 33.01,6.79 v32.93,6.79
MOSI  (via drill 0.39)
  Top 0.178: 31.96,7.26 31.98,7.28 32.03,7.28 32.22,7.46 IC1.30
  Top 0.203: v31.37,6.79 31.49,6.79 31.96,7.26 32.02,7.26
  Bottom 0.203: JP6.1 32.71,6.12 32.23,6.12 31.55,6.79 v31.37,6.79
N$1
  Bottom 0.254: JP7.2 31.69,1.33 JP1.6
N$2
  Bottom 0.254: JP6.2 34.23,1.33 JP1.5
N$3
  Bottom 0.254: JP5.2 JP1.4
N$4
  Bottom 0.254: JP4.2 39.18,1.46 JP1.3
N$5
  Top 0.178: C2.2 29.59,17.93 29.59,16.01 Y1.3 29.41,14.9 29.41,12.76 30.14,12.03 IC1.20
N$6
  Top 0.178: Y1.1 27.7,16.59 26.48,15.37 C3.2 26.48,15.13 27,14.61 28.13,14.61 28.64,14.1 R6.1
N$7
  Top 0.178: IC1.21 29.05,11.63 R6.2
N$8
  Bottom 0.254: JP2.2 41.85,1.33 JP1.2
N$9
  Bottom 0.254: JP9.1 41.66,21.4 JP3.11
N$10
  Top 0.305: U4.5 23.39,14.81 L1.1
N$11
  Bottom 0.254: JP8.1 44.01,21.21 JP3.12
N$12
  Bottom 0.305: JP12.2 JP3.8
N$13
  Bottom 0.305: JP3.9 JP11.2
N$14
  Bottom 0.305: JP3.10 39.37,19.84 JP10.2
NEO_PWR
  Top 0.178: IC1.28 30.29,8.83 29.91,8.45 29.91,6.92 26.54,3.56 C17.1 20.74,3.8 16.88,7.66 LED1.2
NEOPIX
  Top 0.178: IC1.27 30.95,9.25 29.98,9.25 29.53,8.79 29.53,7.14 26.77,4.38 20.77,4.38 18.63,6.53 LED1.1
QSPI_CS
  Top 0.178: IC1.56 38.25,14.03 39.5,15.28 39.5,17.98 39.85,18.33 39.85,19.27 40.51,19.94 43.37,19.94 44.32,18.99 U1.1 44.32,16.95
  Top 0.254: R5.1 45.64,15.39 | 45.64,15.39 45.58,15.33 44.32,16.59 44.32,16.95 | 45.64,15.39 R11.1
QSPI_DATA[0]  (via drill 0.39)
  Top 0.178: IC1.53 38.8,12.83 39.94,13.97 v41.4,13.97 | v40.89,9.65 40.82,9.65 40.51,9.96 U1.5
  Bottom 0.178: v41.4,13.97 41.4,10.16 v40.89,9.65
QSPI_DATA[1]
  Top 0.178: 43.05,18.67 42.23,19.49 41.18,19.49 41.18,16.45 41.18,16.36 41.18,15.36 40.96,15.14 39.98,15.14 38.47,13.63 IC1.55
  Top 0.203: 43.05,18.67 U1.2
QSPI_DATA[2]
  Top 0.178: IC1.54 38.63,13.23 40.15,14.74
  Top 0.203: U1.3 41.78,14.74 40.15,14.74
QSPI_DATA[3]
  Top 0.178: IC1.51 39.16,12.03 39.91,12.78 42.4,12.78 43.05,12.13 U1.7
QSPI_SCK  (via drill 0.39)
  Top 0.178: IC1.52 38.95,12.43 39.8,13.27 42.83,13.27 v42.96,13.4 | v41.97,9.72 41.78,9.91 41.78,11.24 U1.6 | U1.6
  Bottom 0.178: v42.96,13.4 42.96,10.7 v41.97,9.72
RX  (via drill 0.4)
  Top 0.178: v37.21,16.32 36.62,16.32 36.52,16.22 36.52,15.87 36.22,15.57 IC1.3
  Bottom 0.178: JP2.1 38.04,8.51 38.04,14.29 38.59,14.85 38.59,15.66 37.9,16.35 37.88,16.35 37.78,16.45 37.34,16.45 v37.21,16.32
SCK  (via drill 0.39)
  Top 0.178: 31.8,7.98 31.56,7.98
  Top 0.203: IC1.29 31.8,7.98
  Top 0.305: 31.56,7.98 30.91,7.98 v30.73,8.15
  Bottom 0.178: JP7.1 31.69,5.53 31.53,5.69 | v30.73,8.15 30.32,7.74 30.32,6.9 31.09,6.13 | 31.53,5.69 | 31.53,5.69 31.09,6.13 | 31.09,6.13
SCL  (via drill 0.39)  (1 unrouted)
  Top 0.178: 35.68,16.46 35.44,16.21 35.44,15.9 35.42,15.89 IC1.5
  Top 0.305: v9.34,19.3 9.36,19.28 CONN1.4 | v35.41,16.28 35.59,16.46 35.63,16.46 35.63,16.41 35.44,16.21
  Bottom 0.254: 21.37,19.74 19.27,19.74 19.09,19.56 16.87,19.56 16.29,18.98 15.71,18.98 15.49,19.2 13.39,19.2 13.04,19.56 12.81,19.56 12.48,19.23 11.9,19.23 11.58,19.56 11.03,19.56 10.64,19.95 9.98,19.95 v9.34,19.3 9.25,19.3 8.61,18.66 8.03,18.66 7.61,19.08 7.61,19.98 R2.1
  Bottom 0.305: JP9.2 40.35,17.72 38.62,17.72 38.47,17.87 36.34,17.87 36.19,17.72 | 21.37,19.77 21.39,19.77 22.07,20.45 30.04,20.45 31.69,18.8 31.69,18.22 31.77,18.14 34.14,18.14 34.56,17.72 36.19,17.72 | v35.41,16.28 35.66,16.54 35.66,17.19 36.19,17.72
SDA  (via drill 0.39)  (2 unrouted)
  Top 0.178: 43.31,20.51 40.39,20.51 40.01,20.13 38.29,20.13 | 36.13,16.36 36.13,18.96
  Top 0.203: 38.42,19.24 36.45,19.24 36.23,19.02 | IC1.4 35.82,15.73 36.09,16 36.09,16.33 36.13,16.36
  Top 0.254: v45.72,19.33 44.54,20.51 43.31,20.51 | v12.19,19.94 11.49,19.24 v10.35,19.24
  Top 0.305: v10.35,19.24 CONN1.3 | 38.42,20 38.42,19.24 | 38.29,20.13 29.81,20.13 v29.4,19.72
  Bottom 0.254: JP8.2 45.27,19.02 45.3,19.06 45.45,19.06 v45.72,19.33 | R7.1 12.19,20.92 v12.19,19.94
  Bottom 0.305: 21.17,19.26 19.47,19.26 19.29,19.07 17.07,19.07 16.49,18.5 15.51,18.5 15.29,18.72 13.19,18.72 13.16,18.75 11.7,18.75 11.38,19.07 10.83,19.07 10.66,19.24 v10.35,19.24 | 21.17,19.26 21.35,19.07 | v29.4,19.72 22.06,19.72 21.61,19.26 21.17,19.26
SPI_CS  (via drill 0.39)
  Top 0.178: 32.31,8.75 32.38,8.68 32.83,8.68 33.02,8.49 IC1.32
  Top 0.305: v30.99,14.92 31.39,15.32 31.39,17.42 32.64,18.67 v32.64,18.92 | 32.31,8.75 v32.07,8.99
  Bottom 0.305: JP10.1 JP11.1 JP12.1 34.25,18.92 v32.64,18.92 | v30.99,14.92 30.99,10.07 v32.07,8.99
TX  (via drill 0.4)
  Top 0.178: IC1.2 36.64,14.9 36.64,15.41 36.84,15.62 37.62,15.62 v37.75,15.49
  Bottom 0.178: v37.75,15.49 38.17,15.08 38.17,14.96 37.66,14.45 37.66,8.35 38.42,7.59 38.42,5.4 JP4.1
USB_D+  (via drill 0.4)
  Top 0.178: 5.32,10.68 X6.B6 6.8,10.68 7.62,9.87 7.62,9.19 R10.1 | 5.32,10.68 5.21,10.79 5.21,11.56 5.33,11.68 X6.A6 | 5.32,10.68 1.92,10.68 D+1.TP
  other vias: 1.46,10.22
USB_D-  (via drill 0.4)
  Top 0.178: X6.A7 7.39,11.18 R9.1 6.97,12.18 X6.B7 2.04,12.18 D-1.TP
  other vias: 1.4,12.83
USBBOOT  (via drill 0.39)
  Top 0.178: SW2.A SW2.A' 45.36,3.58 46.04,4.25 v46.1,4.25 | v45.59,18.35 45.66,18.29 R11.2
  Bottom 0.178: v45.59,18.35 46.13,17.81 46.13,10.84 46.1,10.8 46.1,9.77 46.41,9.46 46.41,8.57 46.1,8.27 v46.1,4.25
VBAT  (via drill 0.39)
  Top 0.406: v13.1,15.37 13.1,18.97 13.74,19.61 14.46,19.61 14.71,19.86 14.71,20.22 15.47,20.97 15.83,20.97 JP3.1 | v11.87,12.06 11.87,11.29 Q3.3
  Bottom 0.406: v13.1,15.37 13.1,13.29 v11.87,12.06
VBUS  (via drill 0.39)
  Top 0.305: D4.A 10.15,12.09 10.54,11.7 10.54,8.91 Q3.1 | D4.A 10.06,12.19 10.06,12.2 9.09,13.17 9.09,13.96 8.97,14.09 6.93,14.09 6.68,13.83 | JP3.3 21.59,19.01 R4.2 20.99,17.74 v21.4,17.34 | D4.A 10.15,12.89 10.04,13.01 10.04,14.78 10.23,14.97 10.29,14.97 v10.54,15.22
  Bottom 0.305: v10.54,15.22 11.26,15.94 12.63,15.94 12.8,16.1 18.32,16.1 19.59,17.37 19.59,17.51 20.02,17.94 20.62,17.94 21.23,17.34 v21.4,17.34
VHI  (1 unrouted)
  Top 0.305: 18.86,10.99 15.56,10.99 14.34,10.99 C1.1 | C1.1 13.84,10.6 12.32,9.08 Q3.2 | C1.1 13.95,12.1 D4.C 13.85,12.63 14.83,13.6 14.83,16.26 CIN.2 15.37,16.8 | U4.1 21.44,10.92 | 21.44,10.92 U4.8 21.44,14.81 L1.2 | 18.92,10.92 21.44,10.92
VHOST  (via drill 0.39)  (4 unrouted)
  Top 0.305: J1.VBUS 45.38,4.96 45.38,4.59 45.14,4.36 39.91,4.36 39.87,4.32 v28.45,4.32 | v19.11,15.05 COUT.2 | 23.3,8.55 U4.4 23.39,9.87 v25.27,11.75
  Bottom 0.305: v28.45,4.32 27.8,4.97 26.82,4.97 26.07,5.71 21.65,5.71 21.14,6.22 21.14,9.72 19.49,11.37 19.11,11.37 v19.11,15.05 22.42,11.75 v25.27,11.75

### Text on the board
tPlace: 13 | USBBOOT | CHG | Neo | Reset
bPlace: I2C Pullups / 1K 0603 | BAT | En | USB | SCL | SDA | SCK | MOSI | MISO | RX | TX | RST | 3V | 3V | GND